# EAGLE design ble-usb-v1.0 (EAGLE 7.7.0)

## Sheet 1 of 3
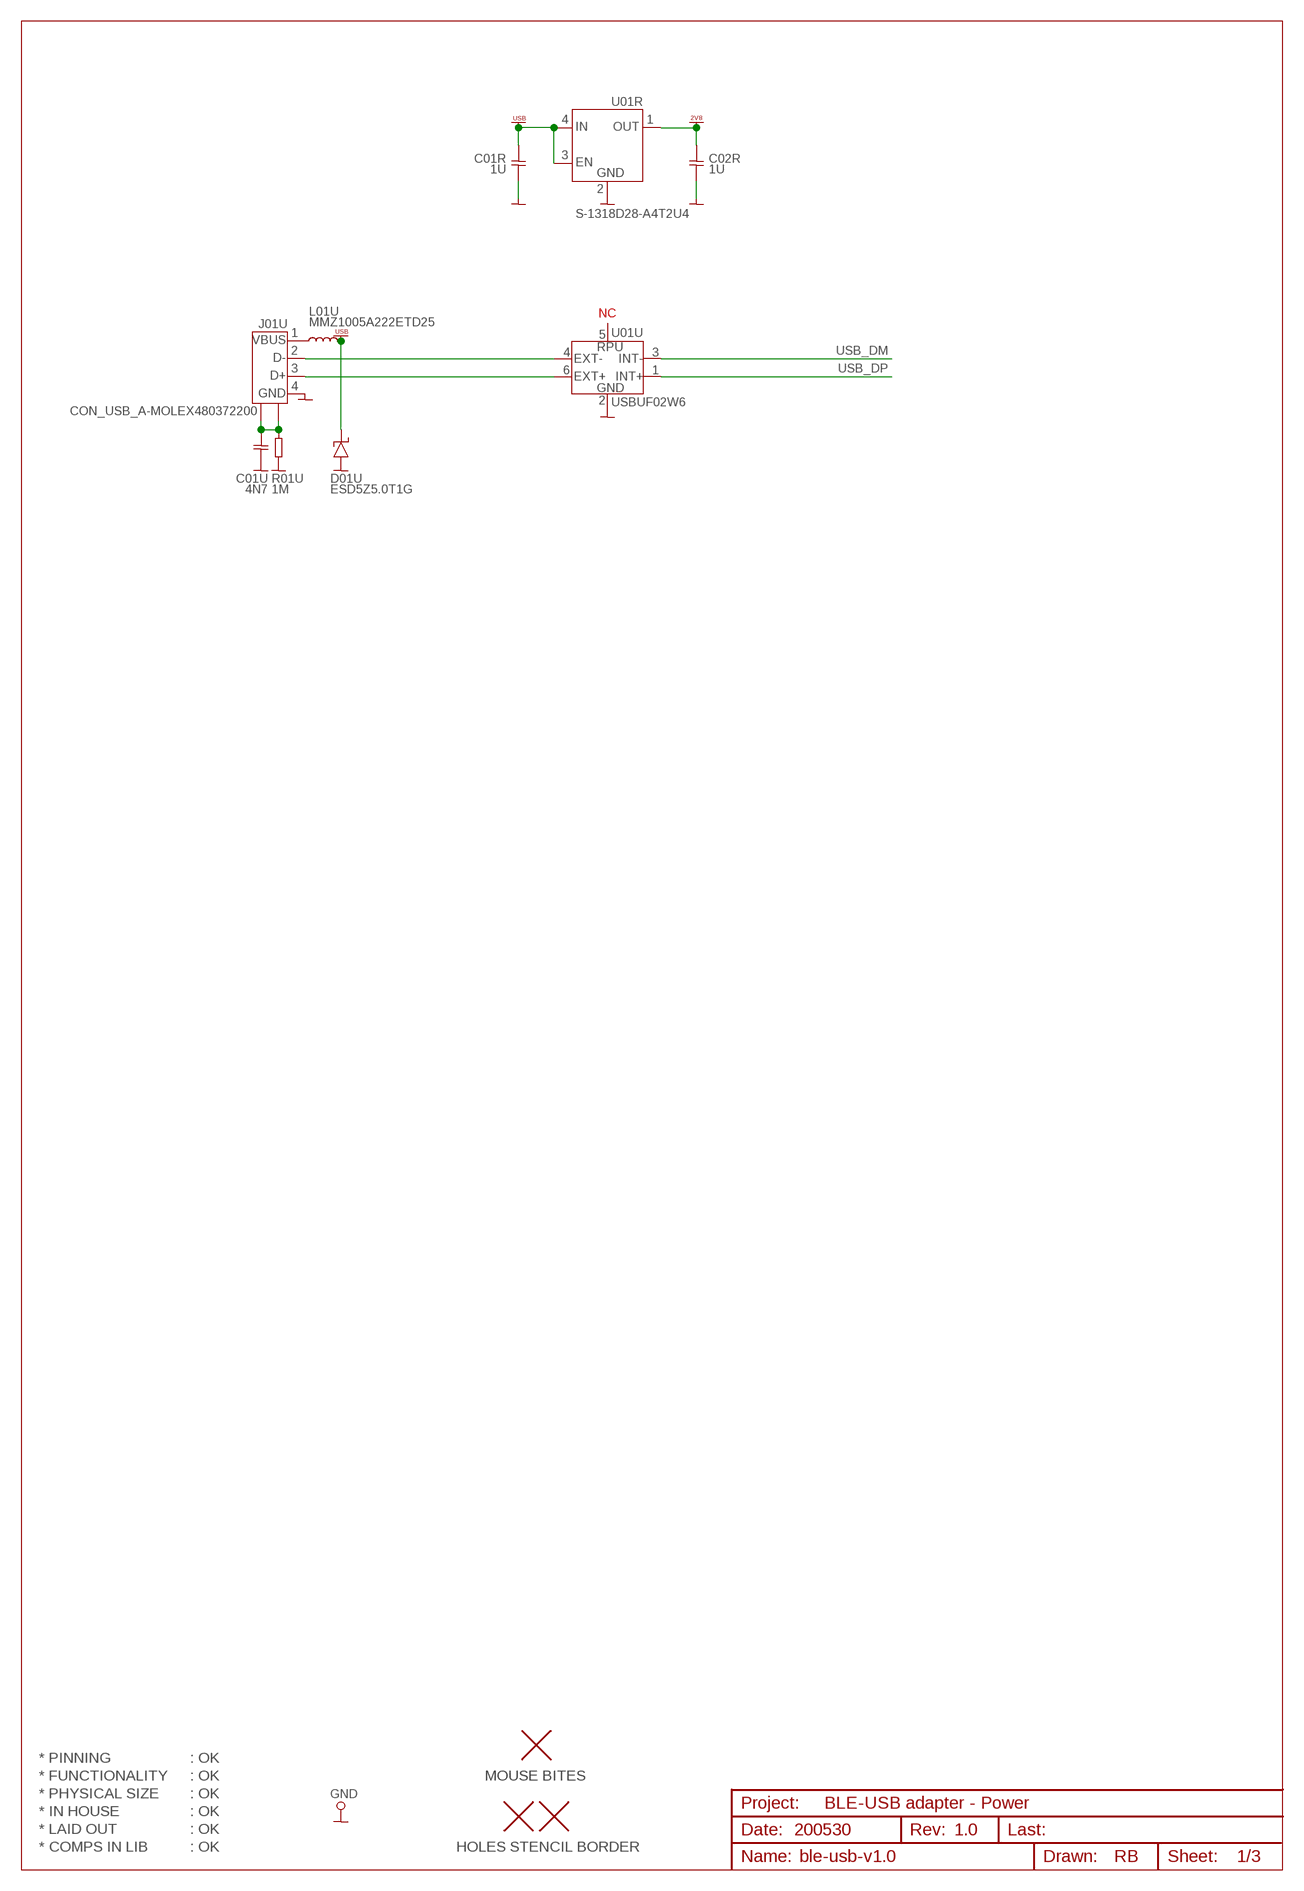
[diagram p0: schematic, sheet 1]

### Parts
C01R  1U  CAP0402  [CAP0402]
C01U  4N7  CAP0402  [CAP0402]
C02R  1U  CAP0402  [CAP0402]
D01U  ESD5Z5.0T1G  DIODE_TVS_SOD523  [DIODE_SOD523]
GND  PIN_TEST_0.6MM  [HOLE_PTH_0.6MM]
H1  HOLE_NPTH_3.0MM-STENCILBORDER  [HOLE_NPTH_3,0MM-STECILBORDER]
H2  HOLE_NPTH_3.0MM-STENCILBORDER  [HOLE_NPTH_3,0MM-STECILBORDER]
H10  HOLE_MOUSEBITES  [HOLE_NPTH_0.5MM]
J01U  CON_USB_A-MOLEX480372200  [CON_USB_A-MOLEX480372200]
L01U  MMZ1005A222ETD25  L_0402  [L_0402]
R01U  1M  RES0402  [RES0402]
U01R  S-1318D28-A4T2U4  [HSNT-4-B]
U01U  USBUF02W6  USBUF  [SOT323-6L]

### Nets
GND: C01R.2 C01U.2 C02R.2 D01U.A GND.1 J01U.4(4.GND) R01U.2 U01R.2(2.GND) U01R.5(2.GND) U01U.2(2.GND) ; also sheet 2,3
N$1: J01U.1(1.VBUS) L01U.1
N$16: J01U.2(2.D-) U01U.4(4.EXT-)
N$18: J01U.3(3.D+) U01U.6(6.EXT+)
USB_CHASSIS: C01U.1 J01U.CASE1(5.CASE) J01U.CASE2(6.CASE) R01U.1
USB_DM: U01U.3(3.INT-) ; also sheet 2
USB_DP: U01U.1(1.INT+) ; also sheet 2
VDD_2V8: C02R.1 U01R.1(1.OUT) ; supply symbol labelled VCC_2V8 ; also sheet 2,3
VDD_USB: C01R.1 D01U.C L01U.2 U01R.3(3.EN) U01R.4(4.IN) ; supply symbol labelled VCC_POWER-USB
Unconnected: U01U.5(5.RPU)

### Notes on the sheet
- NC
- * PINNING | : OK
- * FUNCTIONALITY | : OK | MOUSE BITES
- * PHYSICAL SIZE | : OK
- BLE-USB adapter - Power
- * IN HOUSE | : OK
- * LAID OUT | : OK | 200530 | 1.0
- * COMPS IN LIB | : OK | HOLES STENCIL BORDER

## Sheet 2 of 3
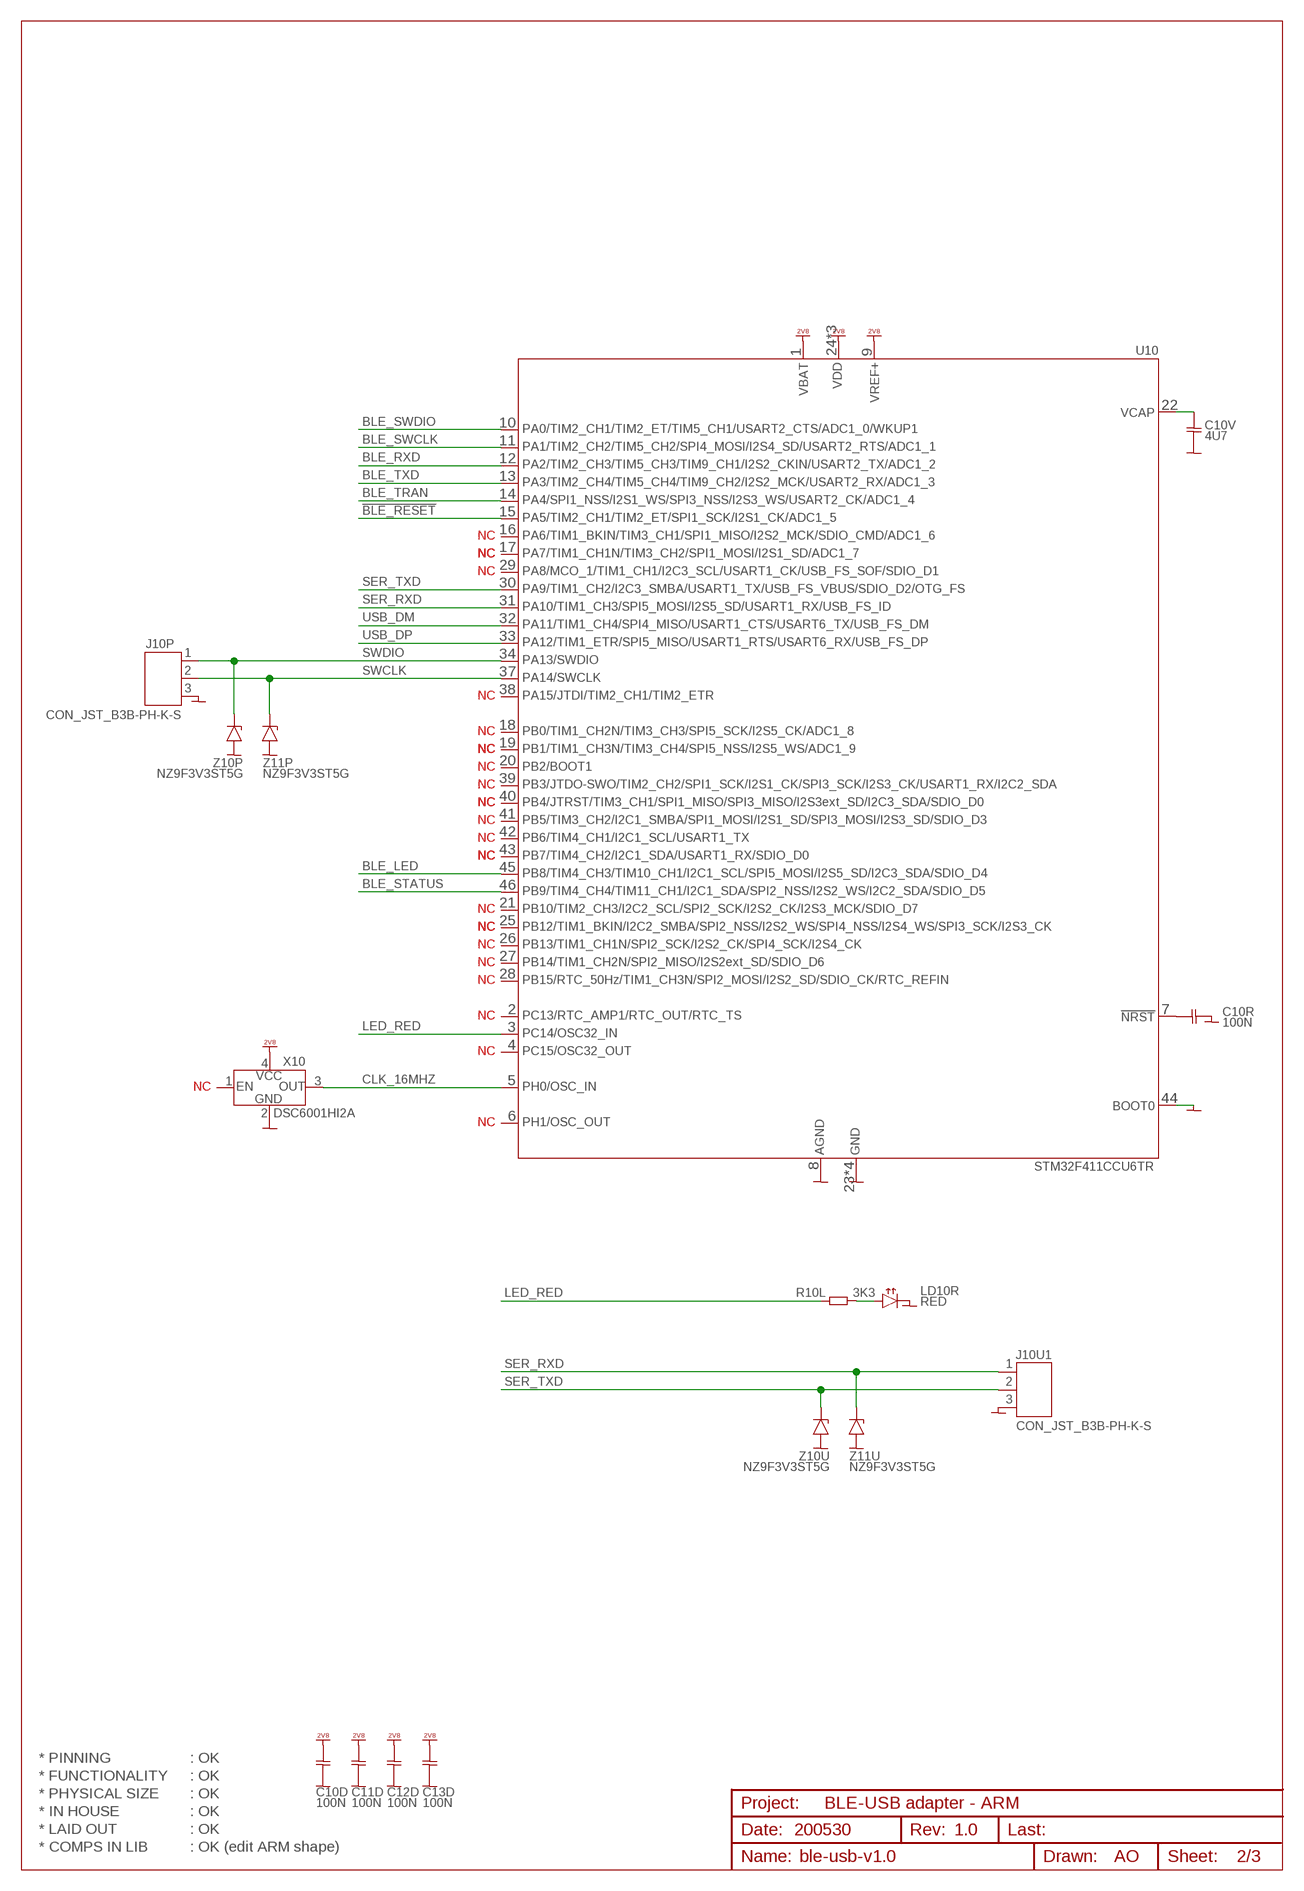
[diagram p1: schematic, sheet 2]

### Parts
C10D  100N  CAP0402  [CAP0402]
C10R  100N  CAP0402  [CAP0402]
C10V  4U7  CAP0402  [CAP0402]
C11D  100N  CAP0402  [CAP0402]
C12D  100N  CAP0402  [CAP0402]
C13D  100N  CAP0402  [CAP0402]
J10P  CON_JST_B3B-PH-K-S  [CON_JST_B3B-PH-K-S]
J10U1  CON_JST_B3B-PH-K-S  [CON_JST_B3B-PH-K-S]
LD10R  RED  LED_SMD_0402  [LED_SMD_0402]
R10L  3K3  RES0402  [RES0402]
U10  STM32F411CCU6TR  [VQFN48]
X10  DSC6001HI2A  DSC6001HI2AVFLGA  [VFLGA4_1.6X1.2MM]
Z10P  NZ9F3V3ST5G  ZENER_SOD923  [ZENER_SOD923]
Z10U  NZ9F3V3ST5G  ZENER_SOD923  [ZENER_SOD923]
Z11P  NZ9F3V3ST5G  ZENER_SOD923  [ZENER_SOD923]
Z11U  NZ9F3V3ST5G  ZENER_SOD923  [ZENER_SOD923]

### Nets
!BLE_RESET: U10.15(PA5) ; also sheet 3
BLE_LED: U10.45(PB8) ; also sheet 3
BLE_RXD: U10.12(PA2) ; also sheet 3
BLE_STATUS: U10.46(PB9) ; also sheet 3
BLE_SWCLK: U10.11(PA1) ; also sheet 3
BLE_SWDIO: U10.10(PA0) ; also sheet 3
BLE_TRAN: U10.14(PA4) ; also sheet 3
BLE_TXD: U10.13(PA3) ; also sheet 3
CLK_16MHZ: U10.5(PH0) X10.3(3.OUT)
GND: C10D.1 C10R.2 C10V.2 C11D.2 C12D.2 C13D.2 J10P.3 J10U1.3 LD10R.C U10.8(VSSA) U10.23(VSS) U10.35(VSS) U10.44(BOOT0) U10.47(VSS) U10.TP(VSS) X10.2(2.GND) Z10P.2(A) Z10U.2(A) Z11P.2(A) Z11U.2(A) ; also sheet 1,3
LED_RED: R10L.1 U10.3(PC14)
N$6: C10R.1 U10.7(NRST)
N$7: LD10R.A R10L.2
N$10: C10V.1 U10.22(VCAP)
SER_RXD: J10U1.1 U10.31(PA10) Z11U.1(C)
SER_TXD: J10U1.2 U10.30(PA9) Z10U.1(C)
SWCLK: J10P.2 U10.37(PA14) Z11P.1(C)
SWDIO: J10P.1 U10.34(PA13) Z10P.1(C)
USB_DM: U10.32(PA11) ; also sheet 1
USB_DP: U10.33(PA12) ; also sheet 1
VDD_2V8: C10D.2 C11D.1 C12D.1 C13D.1 U10.1(VBAT) U10.9(VREF+) U10.24(VDD) U10.36(VDD) U10.48(VDD) X10.4(4.VCC) ; supply symbol labelled VCC_2V8 ; also sheet 1,3
Unconnected: U10.2(PC13) U10.4(PC15) U10.6(PH1) U10.16(PA6) U10.17(PA7) U10.18(PB0) U10.19(PB1) U10.20(PB2) U10.21(PB10) U10.25(PB12) U10.26(PB13) U10.27(PB14) U10.28(PB15) U10.29(PA8) U10.38(PA15) U10.39(PB3) U10.40(PB4) U10.41(PB5) U10.42(PB6) U10.43(PB7) X10.1(1.EN)

### Notes on the sheet
- NC
- NC | NC
- NC
- NC
- NC
- NC | NC
- NC
- NC
- NC | NC
- NC
- NC
- NC | NC
- NC
- NC | NC
- NC
- NC
- NC
- NC
- NC
- NC
- NC
- * PINNING | : OK
- * FUNCTIONALITY | : OK
- * PHYSICAL SIZE | : OK
- BLE-USB adapter - ARM
- * IN HOUSE | : OK
- * LAID OUT | : OK | 200530 | 1.0
- * COMPS IN LIB | : OK (edit ARM shape)

## Sheet 3 of 3
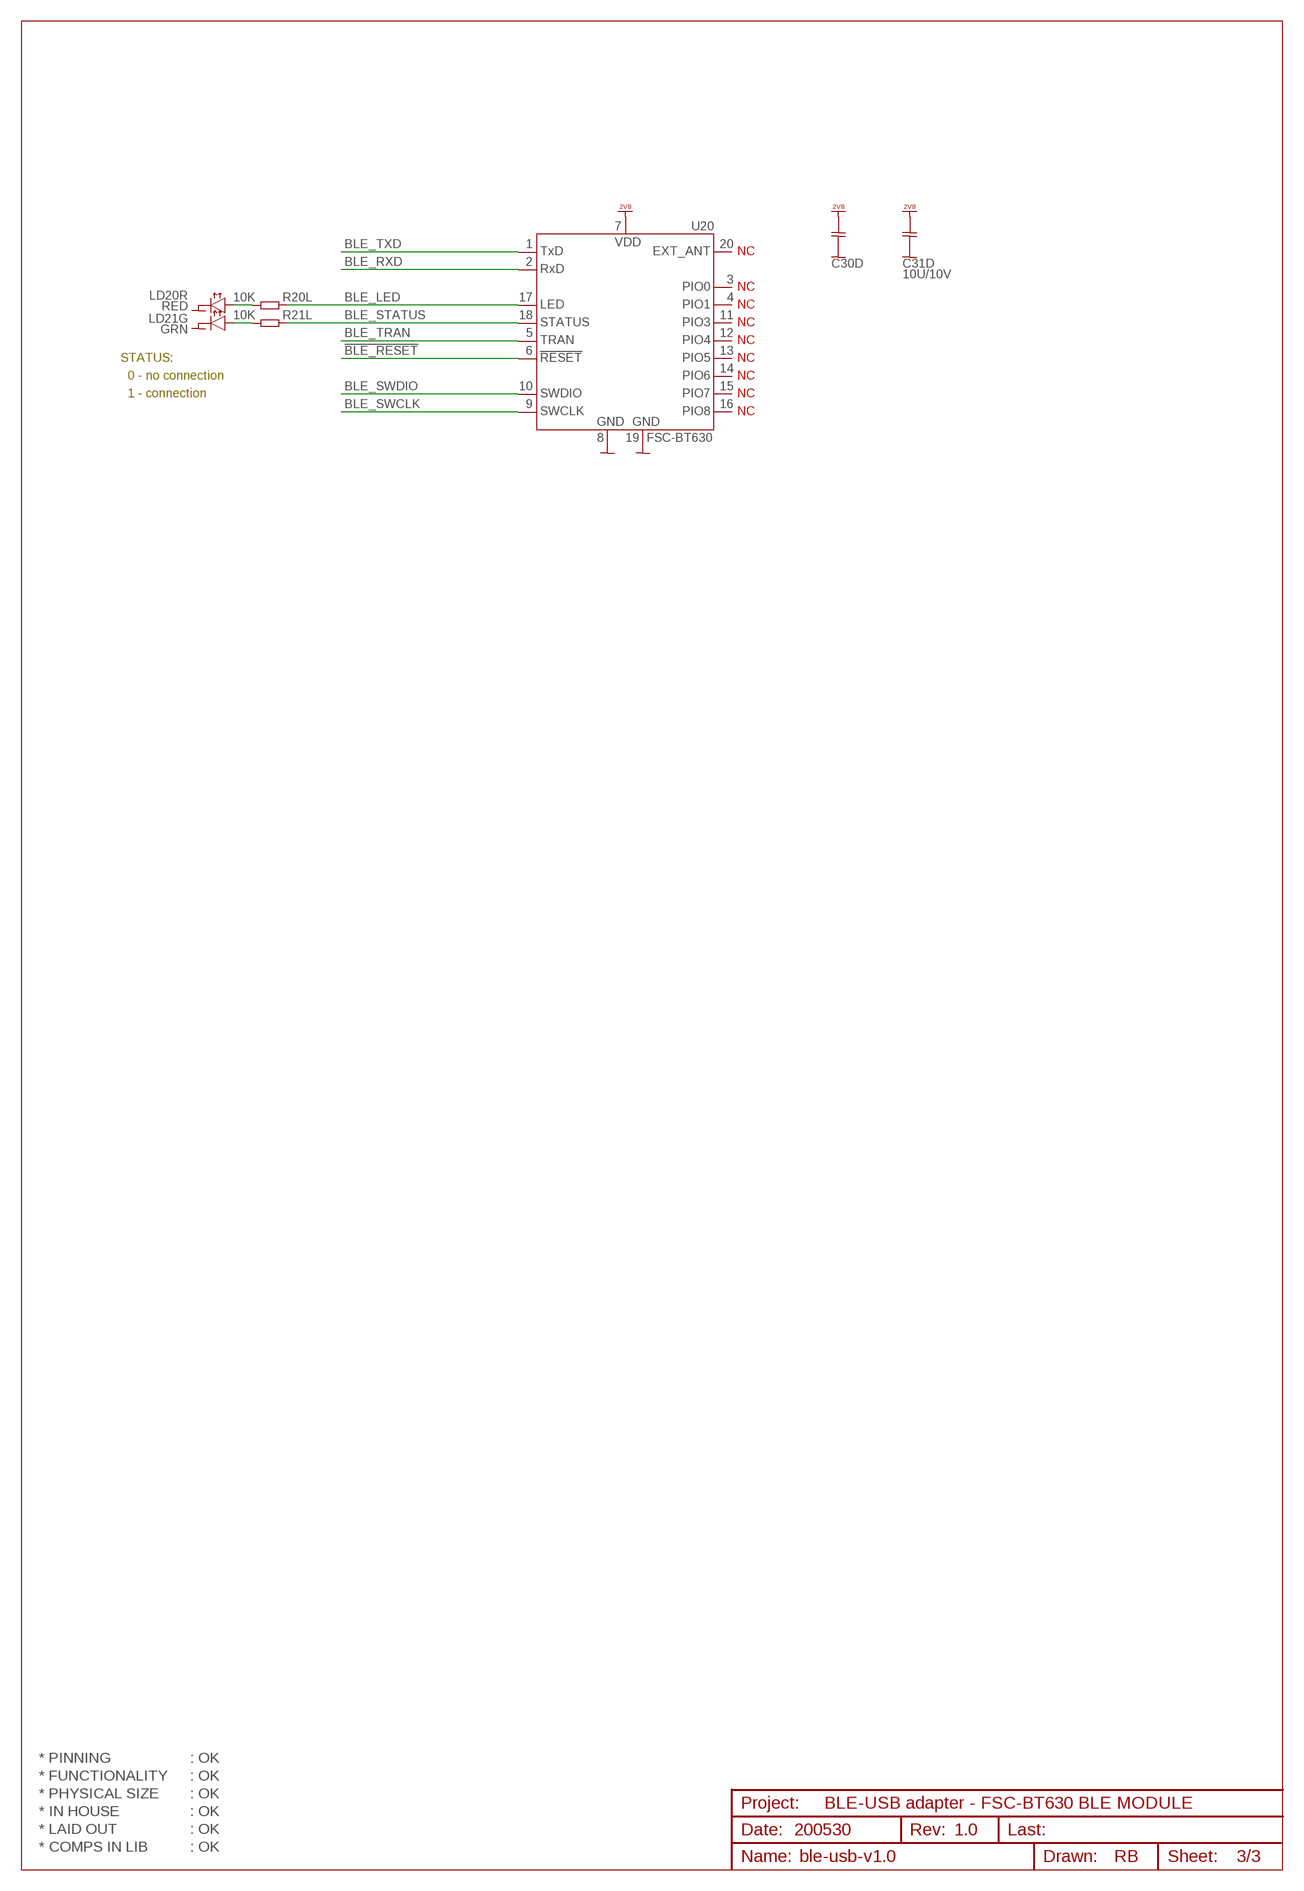
[diagram p2: schematic, sheet 3]

### Parts
C30D  100N  CAP0402  [CAP0402]
C31D  10U/10V  CAP0402  [CAP0402]
LD20R  RED  LED_SMD_0402  [LED_SMD_0402]
LD21G  GRN  LED_SMD_0402  [LED_SMD_0402]
R20L  10K  RES0402  [RES0402]
R21L  10K  RES0402  [RES0402]
U20  FSC-BT630  [FSC-BT630]

### Nets
!BLE_RESET: U20.6(6.!RESET) ; also sheet 2
BLE_LED: R20L.1 U20.17(17.LED) ; also sheet 2
BLE_RXD: U20.2(2.RXD) ; also sheet 2
BLE_STATUS: R21L.1 U20.18(18.STATUS) ; also sheet 2
BLE_SWCLK: U20.9(9.SWCLK) ; also sheet 2
BLE_SWDIO: U20.10(10.SWDIO) ; also sheet 2
BLE_TRAN: U20.5(5.TRAN) ; also sheet 2
BLE_TXD: U20.1(1.TXD) ; also sheet 2
GND: C30D.2 C31D.2 LD20R.C LD21G.C U20.8(8.GND) U20.19(19.GND) ; also sheet 1,2
N$38: LD21G.A R21L.2
N$39: LD20R.A R20L.2
VDD_2V8: C30D.1 C31D.1 U20.7(7.VDD) ; supply symbol labelled VCC_2V8 ; also sheet 1,2
Unconnected: U20.3(3.PIO0) U20.4(4.PIO1) U20.11(11.PIO3) U20.12(12.PIO4) U20.13(13.PIO5) U20.14(14.PIO6) U20.15(15.PIO7) U20.16(16.PIO8) U20.20(20.EXT_ANT)

### Notes on the sheet
- NC
- NC
- NC
- NC
- NC
- STATUS: | NC
- 0 - no connection | NC
- 1 - connection | NC
- NC
- * PINNING | : OK
- * FUNCTIONALITY | : OK
- * PHYSICAL SIZE | : OK
- BLE-USB adapter - FSC-BT630 BLE MODULE
- * IN HOUSE | : OK
- * LAID OUT | : OK | 200530 | 1.0
- * COMPS IN LIB | : OK

## Library data of the parts
C01R C01U C02R C10D C10R C10V C11D C12D C13D C30D C31D = 00-own_parts:CAP0402: Capacitor, ceramic, 0402
D01U = 00-own_parts:DIODE_TVS_SOD523: Diode, transient surpressor, SOD523
GND = 00-own_parts:PIN_TEST_0.6MM: Pin, test pad, hole 0.6mm, pad 1.0mm
H1 H2 = 00-own_parts:HOLE_NPTH_3.0MM-STENCILBORDER: Hole, NPTH, 3.0mm/H8
H10 = 00-own_parts:HOLE_MOUSEBITES: Hole, mousebites
J01U = 00-own_parts:CON_USB_A-MOLEX480372200: Connector, USB A, PCB, SMT, F#231-3729
J10P J10U1 = 00-own_parts:CON_JST_B3B-PH-K-S: Connector, JST, 2.0mm pitch, 3p, top entry
L01U = 00-own_parts:L_0402: Inductor, 0402
LD10R LD20R LD21G = 00-own_parts:LED_SMD_0402: LED, SMD, 0402 (PICOLED)
R01U R10L R20L R21L = 00-own_parts:RES
U01R = 00-own_parts:S-1318D28-A4T2U4: Regulator, LDO w. enable, Vin=1V7..5V5, Vout=2V8, Vdrop=45mV, Iout=100mA, Iss=95nA, HSNT-4-8
U01U = 00-own_parts:USBUF: STM USBUF02W6
U10 = 00-own_parts:STM32F411CCU6TR: MCU, STM32F411CC, ARM Cortex-M4 32-bit MCU+FPU, 125DMIPS, 512KB Flash/128KB RAM, USB OTG FS, 11 TIMs, 1 ADC, 13 comm. interfaces, VQFN48
U20 = 00-own_parts:FSC-BT630: Bluetooth Low Energy module, integrated antenna
X10 = 00-own_parts:DSC6001HI2A: Oscillator, MEMS CMOS, DSC6001HI2A-016.0000, 16Mc, 1V8..3V3, w. enable/disable, 3.2x 2.5mm, VFLGA4
Z10P Z10U Z11P Z11U = 00-own_parts:ZENER_SOD923: Zener, generic SOD923

## Board
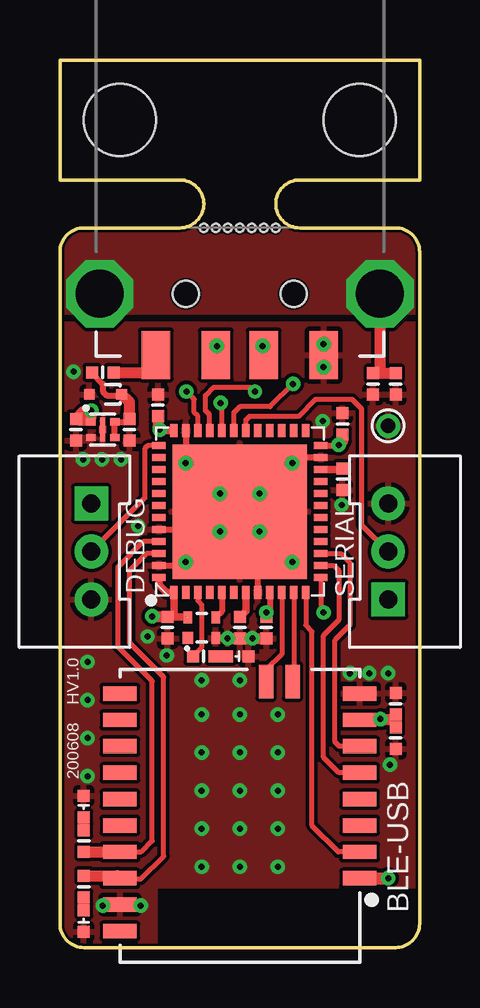
[diagram p3: board, top side]
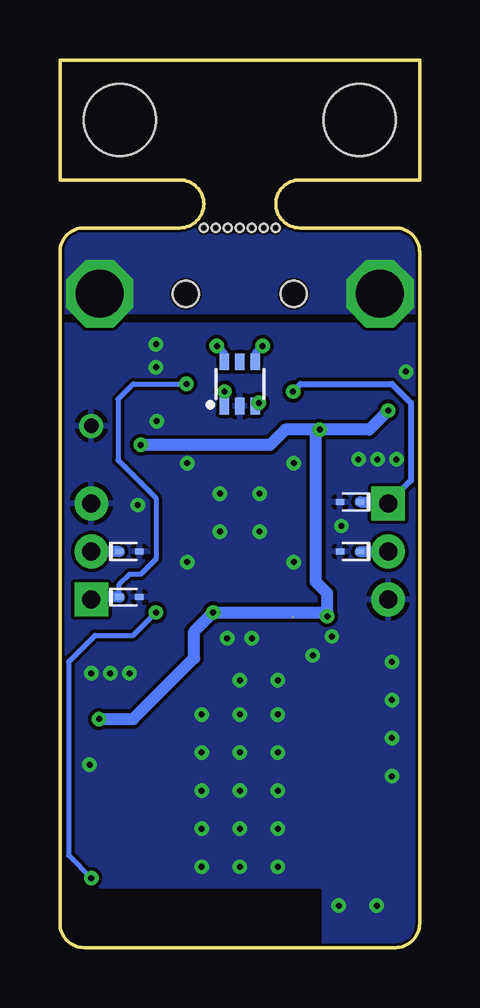
[diagram p4: board, bottom side, seen from below]

Size 15 x 37 mm. Coordinates in mm from the lower left corner, seen from the top.
Outline: 10,30 14,30 arc-90 15,29 15,1 arc-90 14,0 1,0 arc-90 0,1 0,29 arc-90 1,30 5,30
Outline: 5,32 0,32 0,37 15,37 15,32 10,32
Copper layers (1*2*3*16): Top 0.018mm / dielectric 0.36mm / VDD 0.035mm / dielectric 0.71mm / GND 0.035mm / dielectric 0.36mm / Bottom 0.018mm
Design rules "default": minimum track width 0.15mm, minimum drill 0.25mm, track to track 0.15mm, track to pad 0.15mm, pad to pad 0.15mm, via to via 0.15mm, smd to smd 0mil, copper to edge 0.1mm, drill to drill 0.3mm, minimum pad ring 0.175mm, minimum via ring 0.175mm, stop-mask expansion 0.1mm, vias tented up to drill 0.4mm, thermal gap 0.2mm

### Footprints (pad centres in the part's own frame; a part is rotated, then mirrored left to right if it is on the bottom)
CAP0402 = smd 0.5 x 0.5: 1 -0.45,0; 2 0.45,0
DIODE_SOD523 = smd 0.45 x 0.45: A 0.675,0; C -0.675,0
HOLE_PTH_0.6MM = drill 0.6 pad 1: 1 0,0
HOLE_NPTH_3,0MM-STECILBORDER = hole 3: 0,0
HOLE_NPTH_0.5MM = hole 0.35: -1.5,0; -1,0; -0.5,0; 0,0; 0.5,0; 1,0; 1.5,0
CON_USB_A-MOLEX480372200 = smd 2 x 1.2: 1 -5.3,3.5; 2 -5.3,1; 3 -5.3,-1; 4 -5.3,-3.5 | drill 2 pad 2.8 octagon: CASE1 -2.75,5.85; CASE2 -2.75,-5.85 | hole 1.1: -2.75,2.25; -2.75,-2.25
CON_JST_B3B-PH-K-S = drill 0.75 pad 1.4 square: 1 -2,0 | drill 0.75 pad 1.4: 2 0,0; 3 2,0
L_0402 = smd 0.5 x 0.5: 1 -0.45,0; 2 0.45,0
LED_SMD_0402 = smd 0.5 x 0.5: A -0.45,0; C 0.45,0.001
RES0402 = smd 0.5 x 0.5: 1 -0.45,0; 2 0.45,0
HSNT-4-B = smd 0.3 x 0.4: 1 -0.325,-0.5; 2 0.325,-0.5; 3 0.325,0.5; 4 -0.325,0.5 | smd 1 x 0.2: 5 0,0
SOT323-6L = smd 0.4 x 0.7: 1 -0.65,-0.925; 2 0,-0.925; 3 0.65,-0.925; 4 0.65,0.925; 5 0,0.925; 6 -0.65,0.925
VQFN48 = smd 0.3 x 0.55: 1 -2.75,-3.375; 2 -2.25,-3.375; 3 -1.75,-3.375; 4 -1.25,-3.375; 5 -0.75,-3.375; 6 -0.25,-3.375; 7 0.25,-3.375; 8 0.75,-3.375; 9 1.25,-3.375; 10 1.75,-3.375; 11 2.25,-3.375; 12 2.75,-3.375; 25 2.75,3.375; 26 2.25,3.375; 27 1.75,3.375; 28 1.25,3.375; 29 0.75,3.375; 30 0.25,3.375; 31 -0.25,3.375; 32 -0.75,3.375; 33 -1.25,3.375; 34 -1.75,3.375; 35 -2.25,3.375; 36 -2.75,3.375 | smd 0.55 x 0.3: 13 3.375,-2.75; 14 3.375,-2.25; 15 3.375,-1.75; 16 3.375,-1.25; 17 3.375,-0.75; 18 3.375,-0.25; 19 3.375,0.25; 20 3.375,0.75; 21 3.375,1.25; 22 3.375,1.75; 23 3.375,2.25; 24 3.375,2.75; 37 -3.375,2.75; 38 -3.375,2.25; 39 -3.375,1.75; 40 -3.375,1.25; 41 -3.375,0.75; 42 -3.375,0.25; 43 -3.375,-0.25; 44 -3.375,-0.75; 45 -3.375,-1.25; 46 -3.375,-1.75; 47 -3.375,-2.25; 48 -3.375,-2.75 | smd 5.6 x 5.6: TP 0,0
FSC-BT630 = smd 1.4 x 0.6: 1 -5,8.7; 2 -5,7.6; 3 -5,6.5; 4 -5,5.4; 5 -5,4.3; 6 -5,3.2; 7 -5,2.1; 8 -5,1; 11 5,1; 12 5,2.1; 13 5,3.2; 14 5,4.3; 15 5,5.4; 16 5,6.5; 17 5,7.6; 18 5,8.7; 19 5,9.8; 20 5,10.9 | smd 0.6 x 1.4: 9 -2.2,0.5; 10 -1.1,0.5
VFLGA4_1.6X1.2MM = smd 0.43 x 0.5: 1 -0.58,-0.425 | smd 0.35 x 0.5: 2 0.58,-0.425; 3 0.58,0.425; 4 -0.58,0.425
ZENER_SOD923 = smd 0.36 x 0.25: 1 -0.42,0; 2 0.42,0

### Placement (x,y rotation side)
C01R  2.9,21.59 270 top
C01U  13.06,23.5 270 top
C02R  0.67,21.59 270 top
C10D  4.48,13.34 90 top
C10R  7.5,13.34 270 top
C10V  11.79,19.53 270 top
C11D  11.79,21.83 90 top
C12D  8.61,13.34 270 top
C13D  4.09,22.61 90 top
C30D  14.01,8.73 270 top
C31D  14.01,10.16 90 top
D01U  1.9,23.06 180 top
GND  13.69,21.75 270 top
H1  2.5,34.5 0 top
H2  12.5,34.5 0 top
H10  7.5,30 0 top
J01U  7.5,30 90 top
J10P  1.31,16.51 270 top
J10U1  13.69,16.51 90 top
L01U  1.79,23.97 180 top
LD10R  7.42,12.14 0 top
LD20R  0.99,5.87 90 top
LD21G  0.99,1.11 270 top
R01U  14.01,23.5 270 top
R10L  5.99,12.14 0 top
R20L  0.99,4.45 90 top
R21L  0.99,2.54 270 top
U01R  1.79,21.59 270 top
U01U  7.5,23.5 0 bottom
U10  7.5,18.18 0 top
U20  7.5,11.59 180 top
X10  5.91,13.34 0 top
Z10P  2.9,18.57 180 bottom
Z10U  12.1,16.51 0 bottom
Z11P  2.9,16.51 180 bottom
Z11U  12.1,14.61 0 bottom

### Tracks (layer width: path | path; a pad name or v marks a point on that pad's centre or on a via)
!BLE_RESET
  Top 0.203: U20.6 11.65,8.39 11.47,8.57 11.47,12.82 12.1,13.46 12.1,16.03 11.71,16.43 U10.15
BLE_LED
  Top 0.203: U20.17 3.4,4 3.85,4.45 3.85,11.11 2.42,12.54 2.42,15.88 3.47,16.93 U10.45
  Top 0.457: R20L.1 U20.17
BLE_RXD
  Top 0.203: U20.2 11.61,3.99 10.52,5.08 10.52,13.18 10.25,13.44 U10.12
BLE_STATUS
  Top 0.203: 2.4,2.99 2.53,2.86 3.37,2.86 4.33,3.81 4.33,11.27 2.9,12.7 2.9,15.72 3.6,16.43 U10.46
  Top 0.457: R21L.1 2.4,2.99 U20.18
BLE_SWCLK
  Top 0.203: U10.11 9.75,11.14 U20.9
BLE_SWDIO
  Top 0.203: U10.10 9.25,12.23 8.61,11.59 U20.10
BLE_TRAN
  Top 0.203: U20.5 11.64,7.29 10.99,7.94 10.99,13.02 11.63,13.65 11.63,15.72 11.42,15.93 U10.14
BLE_TXD  (via drill 0.25 pad 0.6)
  Top 0.203: U10.13 10.88,14.09 v10.99,13.97
  Top 0.508: U20.1 v13.69,2.89
  Bottom 0.203: v10.99,13.97 11.95,13.02 13.53,13.02 14.64,11.91 14.64,3.84 v13.69,2.89
CLK_16MHZ
  Top 0.254: U10.5 6.75,14.02 X10.3
GND  (via drill 0.25 pad 0.6)
  Top 0.15: 5.3,20.77 5.35,20.73 5.35,20.57
  Top 0.203: v9.69,20.19 9.57,20.19 9.8,20.43
  Top 0.254: U10.23 9.8,20.43 | U10.TP 7.51,18.18 | U10.8 8.25,15.76 8.13,15.88 | U10.35 5.25,20.48 | 5.25,20.35 5.25,20.48 | 5.25,20.48 5.35,20.57 | U10.44 5.24,17.43 | U10.47 4.96,15.93 4.96,15.88 | 5.28,16.03 5.28,16.19 7.5,16.19 7.5,18.1
  Top 0.3: 5.3,20.62 5.35,20.57
  Top 0.305: 5.24,17.43 5.28,17.46 5.28,16.19 | C12D.2 8.61,12.86 | 7.5,12.96 7.5,12.91 | 8.13,15.88 7.5,15.88 7.5,16.19 | X10.2 7.5,12.91 | 7.5,12.91 7.5,12.86
  Top 0.457: v6.99,12.89 C12D.2
  other vias: 10.99,25.15 3.37,1.75 1.79,1.75 12.9,11.43 12.1,11.43 13.69,11.43 13.77,7.62 5.25,20.19 5.25,16.07 9.69,16.07 10.99,24.19 10.96,21.94 4.45,12.18 8.02,12.89 3.26,17.57 0.56,24 5.91,11.14 7.5,11.14 1.15,7.14 11.75,18.45 7.5,9.72 8.33,18.92 8.33,17.34 6.67,17.34 7.5,8.13 7.5,6.54 7.5,4.95 7.5,3.37 5.91,9.72 5.91,8.13 5.91,6.54 5.91,4.95 5.91,3.37 9.09,3.37 9.09,4.95 9.09,6.54 9.09,8.13 9.09,9.72 1.75,20.35 0.96,20.35 2.55,20.35 3.66,12.97 6.67,18.92 1.15,8.73 1.15,10.32 1.15,11.91
  pour Top: 0,0 4.01,0 4.01,2.54 15,2.54 15,26.03 0,26.03
  pour Bottom: 0,0 4.01,0 4.01,2.54 15,2.54 15,26 0,26
LED_RED
  Top 0.203: U10.3 5.75,14.45 5.91,14.29 5.91,12.52 R10L.1
N$1
  Top 0.305: 4.01,24.13 4,24.13 J01U.1
  Top 0.457: L01U.1 3.85,23.97 4.01,24.13
N$6
  Top 0.305: U10.7 7.75,14.04 C10R.1
N$7
  Top 0.457: R10L.2 LD10R.A
N$10
  Top 0.305: U10.22 11.73,19.93 C10V.1
N$16  (via drill 0.25 pad 0.6)
  Top 0.203: J01U.2 6.5,25.04 v6.55,25.08
  Bottom 0.305: U01U.4 6.85,24.78 v6.55,25.08
N$18  (via drill 0.25 pad 0.6)
  Top 0.203: J01U.3 8.5,24.77 8.5,24.88
  Top 0.305: v8.45,25.08 8.45,24.81 8.5,24.77
  Bottom 0.305: U01U.6 8.15,24.78 v8.45,25.08
N$38
  Top 0.457: LD21G.A R21L.2
N$39
  Top 0.457: R20L.2 LD20R.A
SER_RXD  (via drill 0.25 pad 0.6)
  Top 0.203: v9.72,23.5 8.77,22.54 7.5,22.54 7.25,22.29 U10.31
  Bottom 0.203: v9.72,23.5 11.95,23.5 12.58,22.86 12.58,20.32 10.99,18.73 10.99,16.19 11.63,15.56 12.1,15.56 12.52,15.14 Z11U.1
  Bottom 0.457: Z11U.1 13.6,14.61 J10U1.1
SER_TXD
  Top 0.203: U10.30 7.75,22 7.9,22.15 9.96,22.15 10.68,22.86 12.18,22.86 12.58,22.46 12.58,17.62 J10U1.2
  Bottom 0.457: Z10U.1 J10U1.2
SWCLK
  Top 0.203: U10.37 3.66,20.93 3.53,20.8 3.53,18.73 J10P.2
  Bottom 0.457: Z11P.1 J10P.2
SWDIO  (via drill 0.25 pad 0.6)
  Top 0.203: U10.34 5.75,22.15 5.59,22.3 5.59,22.86 v5.28,23.18
  Bottom 0.254: v5.28,23.18 4.96,23.5 1.15,23.5 0.36,22.7 0.36,19.46 J10P.1
  Bottom 0.457: Z10P.1 1.37,18.57 J10P.1
USB_CHASSIS
  Top 0.457: C01U.1 13.37,23.95 | 13.37,23.95 R01U.1 | 13.35,27.49 J01U.CASE2 13.37,27.23 13.37,23.95
  pour Top: 0,26.5 15,26.5 15,30 0,30
  pour Bottom: 0,26.5 15,26.5 15,30 0,30
USB_DM  (via drill 0.25 pad 0.6)
  Top 0.203: U10.32 6.75,22.66 v6.71,22.7
  Bottom 0.203: U01U.3 6.85,22.69 6.72,22.69 v6.71,22.7
USB_DP  (via drill 0.25 pad 0.6)
  Top 0.203: v8.13,23.18 7.98,23.34 6.39,23.34 6.07,23.02 6.07,22.38 6.23,22.23 6.23,21.57 U10.33
  Bottom 0.203: U01U.1 8.15,23.16 v8.13,23.18
VDD_2V8  (via drill 0.25 pad 0.6)  (1 unrouted)
  Top 0.254: U10.9 8.75,14.11 v8.61,13.97 | U10.24 11.6,20.93 v11.63,20.95
  Top 0.305: C10D.2 4.64,13.79 4.75,13.89 U10.1 4.45,14.8 4.12,15.12 U10.48 | C12D.1 v8.61,13.97 | U10.36 4.21,21.55 v4.17,21.59 | U01R.1 0.8,21.91 C02R.1 | 1.29,22.36 1.15,22.36 1.15,22.23 | 5.26,13.79 4.33,13.79
  Top 0.457: C30D.1 14.01,9.53 | 14.01,9.53 C31D.1 | 14.01,9.53 13.97,9.49 13.41,9.49 v13.37,9.53 13.34,9.49 U20.7 | C10D.2 4.33,13.79 3.88,13.79 v3.85,13.81 | 4.1,21.66 v4.17,21.59 4.09,21.67 C13D.1 | C11D.1 11.79,21.11 v11.63,20.95 | 1.29,22.36 0.99,22.36 C02R.1 | 1.29,22.09 1.15,22.23 1.29,22.36 | 1.29,22.36 v1.31,22.38
  Bottom 0.508: v13.37,9.53 11.95,9.53 9.4,12.06 9.4,13.18 v8.61,13.97 3.85,13.97 | v3.85,13.81 3.85,13.97 | 3.85,13.97 3.85,14.76 4.33,15.24 4.33,21.43 v4.17,21.59 | v1.31,22.38 2.1,21.59 v4.17,21.59 | v4.17,21.59 5.59,21.59 6.23,20.95 v11.63,20.95
VDD_USB
  Top 0.254: U01R.3 U01R.4 2.77,21.91 C01R.1 | L01U.2 1.33,23.95 1.79,23.5 1.79,23.18 1.94,23.02 2.54,23.02 D01U.C
  Top 0.457: C01R.1 2.9,22.74 D01U.C

### Text on the board
tPlace: DEBUG | SERIAL | HV1.0 | 200608 | BLE-USB